# Altium schematic sheet Sam4S Basic Board 5.SchDoc: Sam 4S Basic Board 5
size A4; DrawnBy: Igor Bubanja, TIm Oorschot; Address1: ECE Department; Address2: University of Canterbury; Address3: Christchurch 8041; Address4: New Zealand; Revision: 3; SheetNumber: 1; SheetTotal: 3; PageSetup: Record=PageOptions|CenterHorizontal=True|CenterVertical=True|PrintScale=0.97|XCorrection=1.00|YCorrection=1.00|PrintKind=0|BorderSize=5000000|LeftOffset=0|BottomOffset=0|Orientation=2|PaperLength=1000|PaperWidth=1000|Scale=100|PaperSource=7|PrintQuality=-3|MediaType=1|DitherType=10|PrintScaleMode=1|PaperKind=A4 (210 x 297 mm)|PaperIndex=9
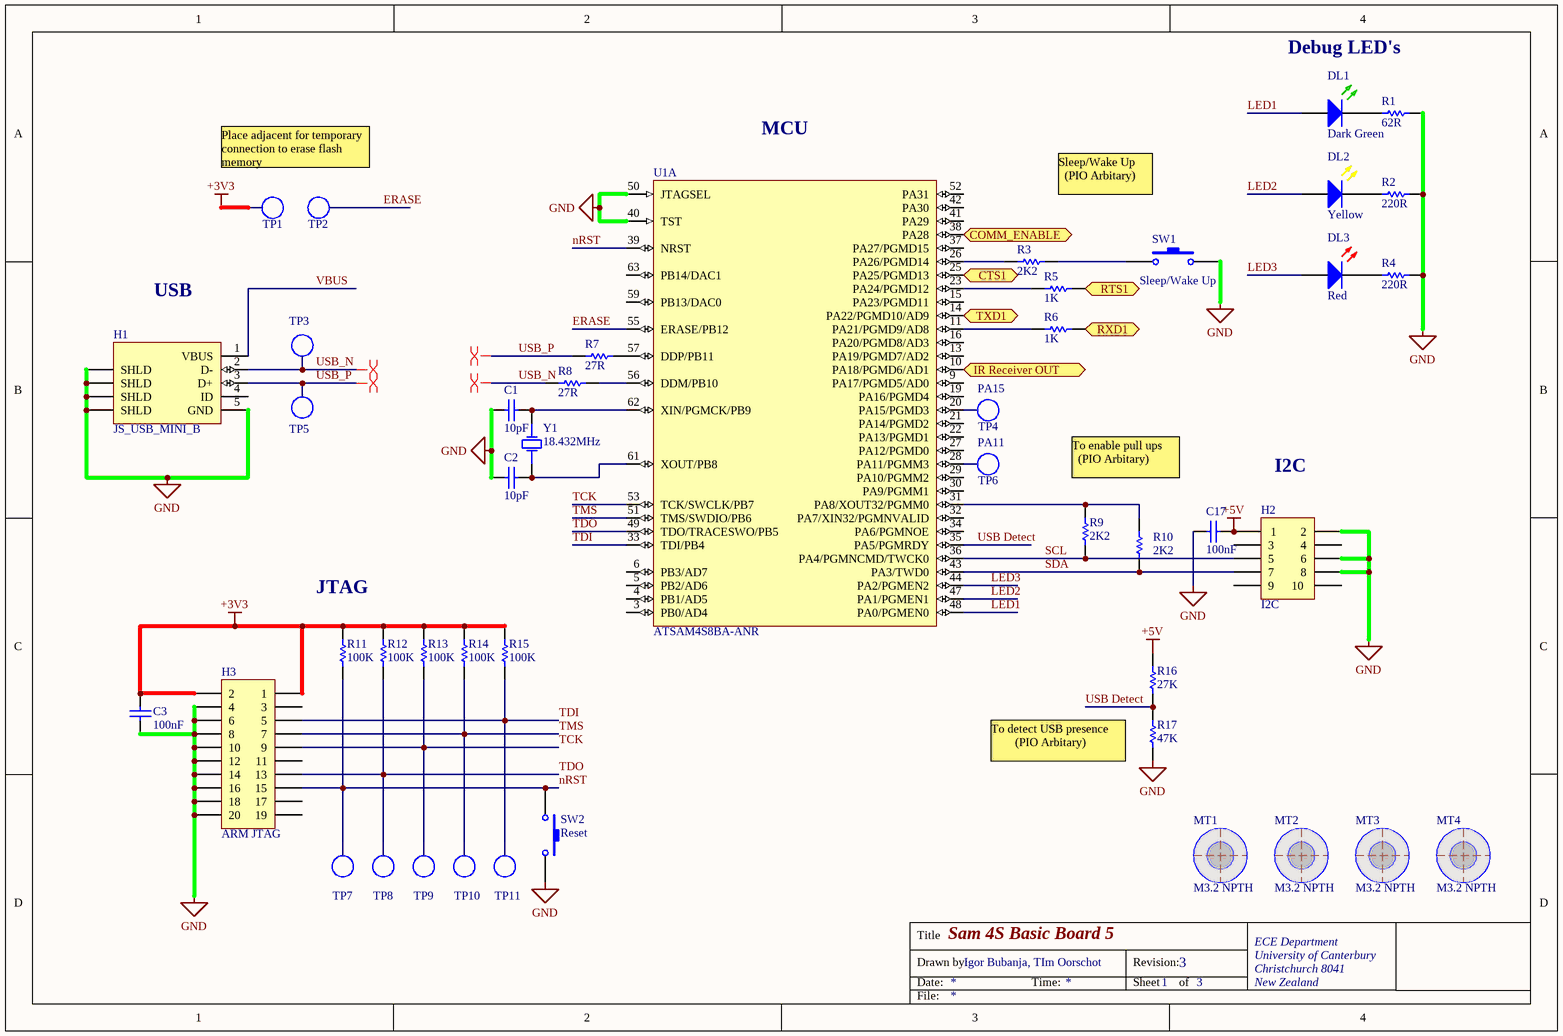
[diagram p0: Sam4S Basic Board 5.SchDoc]

## Parts
C1  10pF  [CAPC1608L]
C2  10pF  [CAPC1608L]
C3  100nF  [CAPC1608L]
C17  100nF  [CAPC1608L]
DL1  Dark Green  [WL-SMCW0603]
DL2  Yellow  [WL-SMCW0603]
DL3  Red  [WL-SMCW0603]
H1  JS_USB_MINI_B  [USB/SM0.8-6H5]
H2  I2C  [188275-10]
H3  ARM JTAG  [188275-20]
MT1  M3.2 NPTH  [MNT-HOLE_3.2mm_NPTH]  (no BOM)
MT2  M3.2 NPTH  [MNT-HOLE_3.2mm_NPTH]  (no BOM)
MT3  M3.2 NPTH  [MNT-HOLE_3.2mm_NPTH]  (no BOM)
MT4  M3.2 NPTH  [MNT-HOLE_3.2mm_NPTH]  (no BOM)
R1  62R  [RESC1608L]
R2  220R  [RESC1608L]
R3  2K2  [RESC1608L]
R4  220R  [RESC1608L]
R5  1K  [RESC1608L]
R6  1K  [RESC1608L]
R7  27R  [RESC1608L]
R8  27R  [RESC1608L]
R9  2K2  [RESC1608L]
R10  2K2  [RESC1608L]
R11  100K  [RESC1608L]
R12  100K  [RESC1608L]
R13  100K  [RESC1608L]
R14  100K  [RESC1608L]
R15  100K  [RESC1608L]
R16  27K  [RESC1608N]
R17  47K  [RESC1608N]
SW1  Sleep/Wake Up  [KSR211G]
SW2  Reset  [KSR211G]
TP1  3V3  [TP_0805]  (value not drawn)
TP2  Erase  [TP_0805]  (value not drawn)
TP3  USB_N  [TP_0805]  (value not drawn)
TP4  PA15  [TP_0805]
TP5  USB_P  [TP_0805]  (value not drawn)
TP6  PA11  [TP_0805]
TP7  nRST  [TP_0805]  (value not drawn)
TP8  TDO  [TP_0805]  (value not drawn)
TP9  TCK  [TP_0805]  (value not drawn)
TP10  TMS  [TP_0805]  (value not drawn)
TP11  TDI  [TP_0805]  (value not drawn)
U1  ATSAM4S8BA-ANR  [LQFP64_L]  (part A of 2)
Y1  18.432MHz  [6.0X3.5-4]

## Ports
COMM_ENABLE, CTS1, IR Receiver OUT, RTS1, RXD1, TXD1

## Nets
+3V3: C3.2 H3.1 H3.2 R11.2 R12.2 R13.2 R14.2 R15.2 TP1.1(TP)
+5V: C17.2 H2.1 R16.2
GND: C1.1 C2.1 C3.1 C17.1 H1.5(GND) H1.6(SHLD) H1.7(SHLD) H1.8(SHLD) H1.9(SHLD) H2.2 H2.6 H2.8 H3.4 H3.6 H3.8 H3.10 H3.12 H3.14 H3.16 H3.18 H3.20 R1.2 R2.2 R4.2 R17.1 SW1.2 SW2.2 U1.40(TST) U1.50(JTAGSEL)
COMM_ENABLE: U1.38(PA28) ; port COMM_ENABLE
CTS1: U1.25(PA25/PGMD13) ; port CTS1
ERASE: TP2.1(TP) U1.55(ERASE/PB12)
IR Receiver OUT: U1.10(PA18/PGMD6/AD1) ; port IR Receiver OUT
LED1: DL1.2(A) U1.48(PA0/PGMEN0)
LED2: DL2.2(A) U1.47(PA1/PGMEN1)
LED3: DL3.2(A) U1.44(PA2/PGMEN2)
nRST: H3.15 R11.1 SW2.1 TP7.1(TP) U1.39(NRST)
RTS1: R5.2 ; port RTS1
RXD1: R6.2 ; port RXD1
SCL: H2.5 R9.1 U1.36(PA4/PGMNCMD/TWCK0)
SDA: H2.7 R10.1 U1.43(PA3/TWD0)
TCK: H3.9 R13.1 TP9.1(TP) U1.53(TCK/SWCLK/PB7)
TDI: H3.5 R15.1 TP11.1(TP) U1.33(TDI/PB4)
TDO: H3.13 R12.1 TP8.1(TP) U1.49(TDO/TRACESWO/PB5)
TMS: H3.7 R14.1 TP10.1(TP) U1.51(TMS/SWDIO/PB6)
TXD1: U1.14(PA22/PGMD10/AD9) ; port TXD1
USB Detect: R16.1 R17.2 U1.35(PA5/PGMRDY)
USB_N: H1.2(D-) R8.1 TP3.1(TP)
USB_P: H1.3(D+) R7.1 TP5.1(TP)
VBUS: H1.1(VBUS)
NetC1_2: C1.2 U1.62(XIN/PGMCK/PB9) Y1.3(OSC2)
NetC2_2: C2.2 U1.61(XOUT/PB8) Y1.1(OSC1)
NetDL1_1: DL1.1(K) R1.1
NetDL2_1: DL2.1(K) R2.1
NetDL3_1: DL3.1(K) R4.1
NetR3_1: R3.1 U1.26(PA26/PGMD14)
NetR3_2: R3.2 SW1.1
NetR5_1: R5.1 U1.23(PA24/PGMD12)
NetR6_1: R6.1 U1.11(PA21/PGMD9/AD8)
NetR7_2: R7.2 U1.57(DDP/PB11)
NetR8_2: R8.2 U1.56(DDM/PB10)
NetR9_2: R9.2 R10.2 U1.31(PA8/XOUT32/PGMM0)
NetTP4_1: TP4.1(TP) U1.20(PA15/PGMD3)
NetTP6_1: TP6.1(TP) U1.28(PA11/PGMM3)

Not connected (* = marked no-connect by the designer): H1 4(ID); H2 3 4 9 10; H3 3 11 17 19; U1 3(PB0/AD4) 4(PB1/AD5) 5(PB2/AD6) 6(PB3/AD7) 9(PA17/PGMD5/AD0) 13(PA19/PGMD7/AD2) 15(PA23/PGMD11) 16(PA20/PGMD8/AD3) 19(PA16/PGMD4) 21(PA14/PGMD2) 22(PA13/PGMD1) 27(PA12/PGMD0) 29(PA10/PGMM2) 30(PA9/PGMM1) 32(PA7/XIN32/PGMNVALID) 34(PA6/PGMNOE) 37(PA27/PGMD15) 41(PA29) 42(PA30) 52(PA31) 59(PB13/DAC0) 63(PB14/DAC1)

## Layout directives
differential pair: USB_N, USB_P

## Notes on the sheet
- Debug LED's
- Place adjacent for temporary
  connection to erase flash
  memory
- MCU
- Sleep/Wake Up
  (PIO Arbitary)
- USB
- To enable pull ups
  (PIO Arbitary)
- I2C
- JTAG
- To detect USB presence
  (PIO Arbitary)
- Title
- Drawn by:
- Date:
- Time:
- Revision:
- Sheet
- of
- File:

## Library data of the parts
C1 C2 = CC_10pF_0603: CAP CER 10pF COG/NPO 50V 0603; PackageReference: 0603; Code_IPC: 1005 [0402]; Verify: *; Supplier: ECE Dept; Storage Location: PCB Assembly WS; Value: 10pF
C3 C17 = CC_100nF_0603: CAP CER 100nF X7R +-10% 50V 0603; PackageReference: 0603; Code_IPC: 1608 [0603]; Verify: *; Supplier: ECE Dept; Storage Location: PCB Assembly WS; Value: 100nF
DL1 = DL_150060GS75000: LED Dk Green 430mcd 0603 SMD; Manufacturer: WURTH ELEKTRONIK; Forward Current If: 30; Wavelength Typ: 520; Forward Voltage: 3.2; Lens Shape: Rectangular; Luminous Intensity: 430; Viewing Angle: 140°; LED Mounting: SMD; Supplier 1: Farnell; Supplier Part Number 1: 2322070; Manufacturer Part Number: 150060GS75000; Storage Location: PCB Assembly WS; Supplier: ECE Dept; LED Colour: Dark Green
DL2 = DL_150060YS75000: LED Yellow 120mcd 0603 SMD; Manufacturer: WURTH ELEKTRONIK; Forward Current If: 30; Forward Voltage: 2; Wavelength Typ: 590; Lens Shape: Rectangular; Viewing Angle: 140°; Luminous Intensity: 120; LED Mounting: SMD; Supplier 1: Farnell; Supplier Part Number 1: 2322074; Manufacturer Part Number: 150060YS75000; Storage Location: PCB Assembly WS; Supplier: ECE Dept; LED Colour: Yellow
DL3 = DL_150060RS75000: LED Red 250mcd 0603 SMD; Manufacturer: WURTH ELEKTRONIK; Forward Current If: 30; Forward Voltage: 2; Lens Shape: Rectangular; Luminous Intensity: 250; Wavelength Typ: 625; Viewing Angle: 140°; LED Mounting: SMD; Supplier 1: Farnell; Supplier Part Number 1: 2322071; Manufacturer Part Number: 150060RS75000; Storage Location: PCB Assembly WS; Supplier: ECE Dept; LED Colour: Red
H1 = JS_USB_MINI_B_SMT: USB 2.0, Right Angle, SMT, B Type, Receptacle, 5 Position,; Manufacturer: FCI; Manufacturer PN: 10033526-N3212MLF; Supplier 1: Farnell; Supplier Part Number 1: 1824416; Storage Location: PCB Assembly WS; Supplier: ECE Dept
H2 = JB_HDR_IDC_5X2_VERT: IDC Header, 1,27mm, 10-Pin, Vert, SMT; Manufacturer: TE Connectivity; Manufacturer Part Number: 1-188275-0; Current Rating: 1.5 A; Mounting Angle: Vertical; Number of Positions / Contacts: 10; Pitch: 1.27 mm; Supplier: ECE Dept; Mounting Style: SMD/SMT; Storage Location: PCB Assembly WS; Supplier 1: Digi-Key; Supplier Part Number 1: A99476TR-ND
H3 = JB_HDR_IDC_10X2_VERT: IDC Header, 1,27mm, 20-Pin, Vert, SMT; Manufacturer: TE Connectivity; Manufacturer Part Number: 2-188275-0; Mounting Angle: Vertical; Number of Positions / Contacts: 20; Pitch: 1.27 mm; Mounting Style: SMD/SMT; Supplier: ECE Dept; Storage Location: PCB Assembly WS; Supplier 1: Digi-Key; Supplier Part Number 1: A99481CT-ND
MT1-MT4 = MC_M3.2_HOLE: Fixing M3.2 Mount Hole NPTH; Manufacturer: Hi-Q; Manufacturer PN: 3BV series M3 Clearance; price: 0; Supplier: ECE Dept; value: M3.2 NPTH
R1 = RS_62R: RES 62 OHM 1/10W 5% 0603 SMD; Storage Location: PCB Assembly WS; Supplier: ECE Dept; Value: 62R
R2 R4 = RS_220R: RES 220 OHM 1/10W 5% 0603 SMD; Storage Location: PCB Assembly WS; Supplier: ECE Dept; Value: 220R
R3 R9 R10 = RS_2K2: RES 2.2K OHM 1/10W 5% 0603 SMD; Storage Location: PCB Assembly WS; Supplier: ECE Dept; Value: 2K2
R5 R6 = RS_1K: RES 1.0K OHM 1/10W 5% 0603 SMD; Storage Location: PCB Assembly WS; Supplier: ECE Dept; Value: 1K
R7 R8 = RS_27R: RES 27 OHM 1/10W 5% 0603 SMD; Storage Location: PCB Assembly WS; Supplier: ECE Dept; Value: 27R
R11-R15 = RS_100K: RES 100K OHM 1/10W 5% 0603 SMD; Storage Location: PCB Assembly WS; Supplier: ECE Dept; Value: 100K
R16 = RS_27K: RES 27K OHM 1/10W 5% 0603 SMD; Storage Location: PCB Assembly WS; Supplier: ECE Dept; Value: 27K
R17 = RS_47K: RES 47.0K OHM 1/10W 5% 0603 SMD; Storage Location: PCB Assembly WS; Supplier: ECE Dept; Value: 47K
SW1 SW2 = WS_KSR211G LFS: SWITCH TACTILE SPST-NO SMD; Manufacturer: C & K COMPONENTS; Contact Current Max: 50; Contact Resistance: 100; Contact Voltage DC Nom: 32; Operating Force: 1.8; Contact Configuration: SPST-NO; Pricing: 1=0.538, 50=0.477, 100=0.416, 2500=0.219 (NZD); Supplier 1: Farnell; Supplier Part Number 1: 1437634; Storage Location: PCB Assembly WS; Supplier: ECE Dept; Manufacturer Part Number: KSR211G LFS
TP1-TP11 = TP_0805: Test Point 2.0X0.9X1.2mm SMD; Manufacturer: TE Connectivity AMP Connectors; Manufacturer Part Number: 1625854-2; Supplier 1: Digi-Key; Mounting Type: Surface Mount; Terminal: 0.079" x 0.049" x 0.057" (2.00mm x 1.25mm x 1.45mm); Type: PC Test Point; Supplier Part Number 1: A106144CT-ND
U1 = SE_ATSAM4S16BA-MU: IC MCU 32BIT 512KB FLASH 64LQFP; Manufacturer: Atmel; Connectivity: I²C, IrDA, Memory Card, SPI, SSC, UART/USART, USB; Core Processor: ARM® Cortex®-M4; Core Size: 32-Bit; Data Converters: A/D 11x12b, D/A 2x12b; Number of I/O: 47; Peripherals: Brown-out Detect/Reset, DMA, POR, PWM, WDT; Program Memory Size: 512KB (512K x 8); RAM Size: 128K x 8; Speed: 120MHz; Voltage - Supply (Vcc/Vdd): 1.62 V ~ 3.6 V; PackageVersion: revJ, Jul-2007; PackageReference: 64PS; PackageDescription: 64-Pin Quad Flat No-Lead (QFN) Sawn, 9 x 9 x 1.0 mm Body, 0.5 mm Pitch, Exposed Pad; Code_JEDEC: MO-220VMMD-3; ComponentLink1Description: Manufacturer URL; ComponentLink1URL: http://www.atmel.com/; ComponentLink2Description: SAM4S Series Datasheet; ComponentLink2URL: http://www.atmel.com/dyn/resources/prod_documents/11100.pdf; ComponentLink3Description: SAM4S Series Summary; ComponentLink3URL: http://www.atmel.com/dyn/resources/prod_documents/11100S.pdf; Supplier 1: Digi-Key; Package / Case: 64-LQFP; Packaging: Cut Tape (CT); Program Memory Type: FLASH; Supplier Part Number 1: ATSAM4S8BA-ANRCT-ND; Manufacturer Part Number: ATSAM4S8BA-ANR
Y1 = XT_CRYSTAL_18.432MHz_13pF: 18.432 MHZ 4PF  6.0X3.5mm SMD; Manufacturer: CTS-Frequency Controls; Manufacturer Part Number: 406C35B18M43200; ESR (Equivalent Series Resistance): 40 Ohm; Frequency Stability: ±50ppm; Frequency Tolerance: ±30ppm; Load Capacitance: 13pF; Supplier 1: Digi-Key; Height: 0.047" (1.20mm); Mounting Type: Surface Mount; Package / Case: 4-SMD, No Lead (DFN, LCC); Size / Dimension: 0.236" L x 0.138" W (6.00mm x 3.50mm); Supplier Part Number 1: CTX668CT-ND; Frequency: 18.432MHz